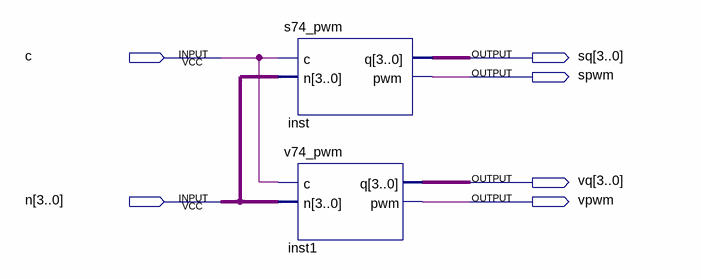
[diagram p0: schematic sheet]
// Quartus schematic sw_pwm.bdf as structural Verilog: 2 symbols, 6 pins
module sw_pwm (
  input  c,
  input  [3:0] n,
  output [3:0] sq,
  output spwm,
  output [3:0] vq,
  output vpwm
);

  s74_pwm inst (.c(c), .n(n), .q(sq), .pwm(spwm));
  v74_pwm inst1 (.c(c), .n(n), .q(vq), .pwm(vpwm));
endmodule
